# Altium project soldering_station_revB.PrjPcb
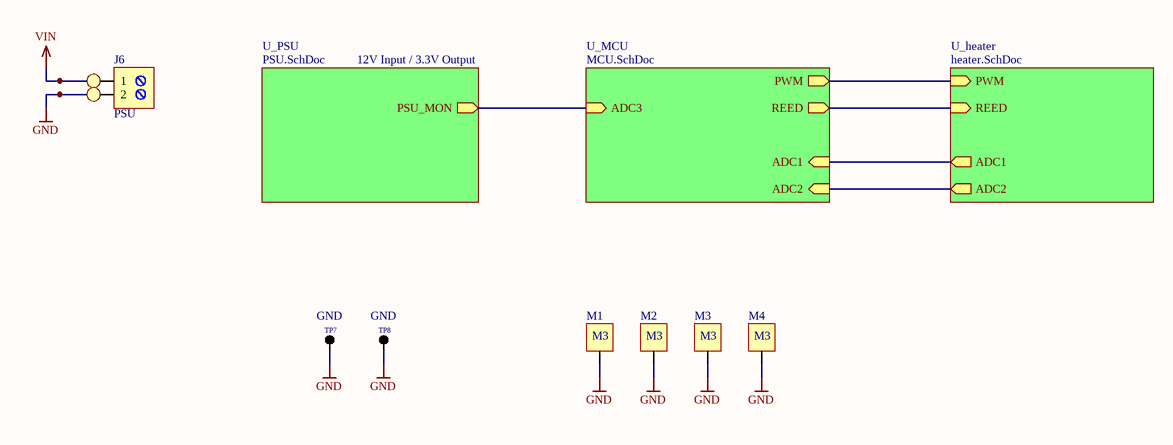
[diagram p0: top.SchDoc]
4 sheets, 97 parts. Net scope: hierarchical (ports join the sheet entries above them; power ports are global).
Board file: soldering_station_revB.PcbDoc
Sheets:
  top.SchDoc
    U_PSU = PSU.SchDoc
    U_MCU = MCU.SchDoc
    U_heater = heater.SchDoc

## Sheet top.SchDoc
size A4

### Parts
J6  PSU  [J_ARK2]
M1  M3 Hole  [M3 Hole]  (value not drawn)
M2  M3 Hole  [M3 Hole]  (value not drawn)
M3  M3 Hole  [M3 Hole]  (value not drawn)
M4  M3 Hole  [M3 Hole]  (value not drawn)
PAD1  PAD  [PAD_08mm]  (value not drawn)
PAD2  PAD  [PAD_08mm]  (value not drawn)
TP7  GND  [TP_PAD]
TP8  GND  [TP_PAD]

### Sub-sheets
U_heater = heater.SchDoc: PWM (in), ADC2 (out), ADC1 (out), REED (in)
U_MCU = MCU.SchDoc: PWM (out), ADC2 (in), ADC1 (in), REED (out), ADC3 (in)
U_PSU = PSU.SchDoc: PSU_MON (out)

### Nets
GND: J6.2 M1.1 M2.1 M3.1 M4.1 PAD2.1 TP7.1(TP) TP8.1(TP)
VIN: J6.1 PAD1.1
BUCK_MON: sheet U_PSU/PSU_MON, sheet U_MCU/ADC3
PWM_OUT: sheet U_MCU/PWM, sheet U_heater/PWM
REED: sheet U_MCU/REED, sheet U_heater/REED
TR: sheet U_MCU/ADC2, sheet U_heater/ADC2
NetC2_1: sheet U_MCU/ADC1, sheet U_heater/ADC1

### Notes on the sheet
- 12V Input / 3.3V Output
- (in symbol M3 Hole) M3

### Library data of the parts
J6 = J_TB-5.0-P-2P: ARK Screw terminal, 2-Pin; Manufacturer: DEGSON ELECTRONICS; Value: DG301-5.0-02P-12-18A(H); SCH_Footprint: ARK2; Part Number: J_TB-5.0-P-2P; Component Type: Standard; HelpURL: https://datasheet.octopart.com/DG301-5.0-03P-12-18A%28H%29-Degson-datasheet-17801202.pdf; Manufacturer Part Number: DG301-5.0-02P-12-18A(H); Supplier 1: TME; Supplier Part Number 1: DG301-5.0-2/6B; Supplier 2: RS Components; Supplier 3: Farnell; Supplier 4: Mouser; Supplier 5: Digi-Key
M1-M4 = M3 Hole: Inner diamater 3.25 mm Outer diamerer 6 mm
PAD1 PAD2 = J_PAD: PCB Pad; Part Number: J_PAD; SCH_Footprint: 1.4x2.5mm; Supplier 1: TME; Supplier 2: RS Components; Supplier 3: Farnell; Supplier 4: Mouser; Supplier 5: Digi-Key; Supplier 6: LCSC
TP7 TP8 = TP_PAD: Testpoint; SCH_Footprint: SMD; Part Number: TP_PAD; Supplier 1: TME; Supplier 2: RS Components; Supplier 3: Farnell; Supplier 4: Mouser; Supplier 5: Digi-Key; Supplier 6: LCSC

## Sheet PSU.SchDoc
size A4
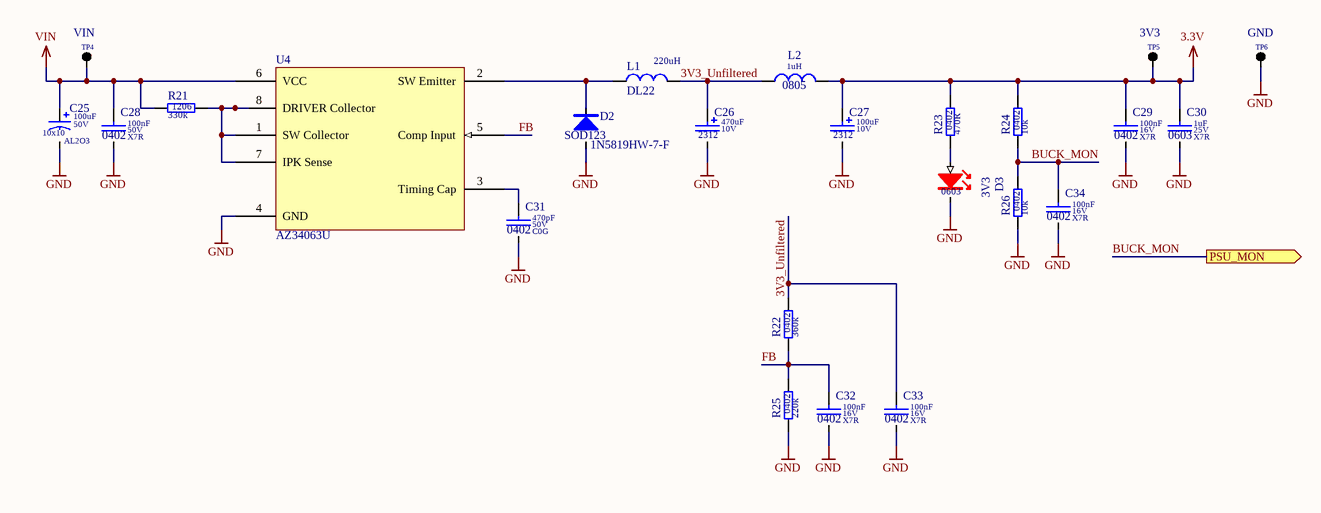
[diagram p1: PSU.SchDoc]

### Parts
C25  value 100uF  Dielectric: AL2O3  SCH_Footprint: 10x10  Voltage: 50V  [CE_D_10x10MM]  (hidden comment: Electrolytic Capacitor)
C26  value 470uF  SCH_Footprint: 2312  Voltage: 10V  [CT_2312_6032]  (hidden comment: Tantalum Capacitor)
C27  value 100uF  SCH_Footprint: 2312  Voltage: 10V  [CT_2312_6032]  (hidden comment: Tantalum Capacitor)
C28  value 100nF  Dielectric: X7R  Voltage: 50V  SCH_Footprint: 0402  [C_0402_1005]  (hidden comment: Ceramic X7R)
C29  value 100nF  Dielectric: X7R  Voltage: 16V  SCH_Footprint: 0402  [C_0402_1005]  (hidden comment: Ceramic X7R)
C30  value 1uF  Dielectric: X7R  Voltage: 25V  SCH_Footprint: 0603  [C_0603_1608]  (hidden comment: Ceramic X7R)
C31  value 470pF  Dielectric: C0G  Voltage: 50V  SCH_Footprint: 0402  [C_0402_1005]  (hidden comment: Ceramic C0G)
C32  value 100nF  Dielectric: X7R  Voltage: 16V  SCH_Footprint: 0402  [C_0402_1005]  (hidden comment: Ceramic X7R)
C33  value 100nF  Dielectric: X7R  Voltage: 16V  SCH_Footprint: 0402  [C_0402_1005]  (hidden comment: Ceramic X7R)
C34  value 100nF  Dielectric: X7R  Voltage: 16V  SCH_Footprint: 0402  [C_0402_1005]  (hidden comment: Ceramic X7R)
D2  value 1N5819HW-7-F  [SOD123]  (hidden comment: 1N5819HW)
D3  3V3  SCH_Footprint: 0603  [OL_0603_1608]
L1  DL22  value 220uH  [DL22]
L2  value 1uH  SCH_Footprint: 0805  [L_0805_2012]  (hidden comment: Inductor)
R21  value 330k  SCH_Footprint: 1206  [R_1206_3216]  (hidden comment: Resistor)
R22  value 360k  SCH_Footprint: 0402  [R_0402_1005]  (hidden comment: Resistor)
R23  value 470R  SCH_Footprint: 0402  [R_0402_1005]  (hidden comment: Resistor)
R24  value 10k  SCH_Footprint: 0402  [R_0402_1005]  (hidden comment: Resistor)
R25  value 220k  SCH_Footprint: 0402  [R_0402_1005]  (hidden comment: Resistor)
R26  value 10k  SCH_Footprint: 0402  [R_0402_1005]  (hidden comment: Resistor)
TP4  VIN  [TP_PAD]
TP5  3V3  [TP_PAD]
TP6  GND  [TP_PAD]
U4  AZ34063U  [AZ34063UMTR-G1]

### Ports
PSU_MON (out)

### Nets
3.3V: C27.1 C29.1 C30.1 L2.2 R23.2 R24.2 TP5.1(TP)
GND: C25.2 C26.2 C27.2 C28.2 C29.2 C30.2 C31.2 C32.2 C33.2 C34.2 D2.2 D3.1(K) R25.1 R26.1 TP6.1(TP) U4.4(GND)
VIN: C25.1 C28.1 R21.1 TP4.1(TP) U4.6(VCC)
3V3_Unfiltered: C26.1 C33.1 L1.1 L2.1 R22.2
BUCK_MON: C34.1 R24.1 R26.2 ; port PSU_MON
FB: C32.1 R22.1 R25.2 U4.5(Comp_Input)
NetC31_1: C31.1 U4.3(Timing_Cap)
NetD2_1: D2.1 L1.2 U4.2(SW_Emitter)
NetD3_2: D3.2(A) R23.1
NetR21_2: R21.2 U4.1(SW_Collector) U4.7(IPK_Sense) U4.8(DRIVER_Collector)

### Library data of the parts
C25 = CE_100uF_50V_AL2O3_10x10_20: Polarized Capacitor; Manufacturer: Nichicon; Manufacturer Part Number: UUX1H101MNL1GS; Tolerance (%): 20; Part Number: CE_100uF_50V_AL2O3_10x10_20; HelpURL: https://datasheet.octopart.com/UUX1H101MNL1GS-Nichicon-datasheet-62047998.pdf; Supplier 1: TME; Supplier Part Number 1: UUX1H101MNL1GS; Supplier 2: RS Components; Supplier Part Number 2: 739-3107; Supplier 3: Farnell; Supplier Part Number 3: 2841943; Supplier 4: Mouser; Supplier Part Number 4: 647-UUX1H101MNL1GS; Supplier 5: Digi-Key; Supplier Part Number 5: 493-6269-1-ND; Supplier 6: LCSC
C26 C27 = CT_22uF_16V_TA2O5_2312_10: Capacitor; Manufacturer: Kemet; Manufacturer Part Number: T494C226K016AT; Dielectric: TA2O5; Tolerance (%): 10; Part Number: CT_22uF_16V_TA2O5_2312_10; HelpURL: https://content.kemet.com/datasheets/KEM_T2008_T494.pdf; Supplier 1: TME; Supplier Part Number 1: T494C226K016AT; Supplier 2: RS Components; Supplier Part Number 2: 1726639; Supplier 3: Farnell; Supplier Part Number 3: 2762195; Supplier 4: Mouser; Supplier Part Number 4: 80-T494C226K016; Supplier 5: Digi-Key; Supplier Part Number 5: 399-3845-1-ND; Supplier 6: LCSC
C28 = C_100nF_50V_X7R_0402_10: Capacitor; Manufacturer: Murata; Manufacturer Part Number: GRM155R71H104KE14D; Tolerance (%): 10; Part Number: C_100nF_50V_X7R_0402_10; HelpURL: http://docs-europe.electrocomponents.com/webdocs/145f/0900766b8145f9d2.pdf; Supplier 1: TME; Supplier Part Number 1: GRM155R71H104KE14D; Supplier 2: RS Components; Supplier Part Number 2: 8847087; Supplier 3: Farnell; Supplier Part Number 3: 2611912; Supplier 4: Mouser; Supplier Part Number 4: 81-GRM155R71H104KE4D; Supplier 5: Digi-Key; Supplier Part Number 5: 490-10700-1-ND; Supplier 6: LCSC
C29 C32-C34 = C_100nF_16V_X7R_0402_10: Capacitor; Manufacturer: Murata; Manufacturer Part Number: GRM155R71C104KA88D; Tolerance (%): 10; Part Number: C_100nF_16V_X7R_0402_10; HelpURL: https://www.mouser.com/ds/2/281/c02e-2905.pdf; Supplier 1: TME; Supplier 2: RS Components; Supplier 3: Farnell; Supplier 4: Mouser; Supplier Part Number 4: 81-GRM155R71C104KA88; Supplier 5: Digi-Key
  C32-C34: Supplier 6: LCSC
C30 = C_1uF_25V_X7R_0603_10: Capacitor; Manufacturer: Samsung; Manufacturer Part Number: CL10B105KA8NNNC; Tolerance (%): 10; Part Number: C_1uF_25V_X7R_0603_10; HelpURL: http://www.tme.eu/pl/Document/4a42202b32dab16128fe107dd69598cc/samsung-chip-cap.pdf; Supplier 1: TME; Supplier Part Number 1: CL10B105KA8NNNC; Supplier 2: RS Components; Supplier 3: Farnell; Supplier 4: Mouser; Supplier 5: Digi-Key
C31 = C_470pF_50V_C0G_0402_5: Capacitor; Manufacturer: AVX; Manufacturer Part Number: 04025A471JAT2A; Tolerance (%): 5; Part Number: C_470pF_50V_C0G_0402_5; HelpURL: http://datasheet.octopart.com/04025A471JAT2A-AVX-datasheet-9883399.pdf; Supplier 1: TME; Supplier 2: RS Components; Supplier Part Number 2: 6983119P; Supplier 3: Farnell; Supplier Part Number 3: 2280781; Supplier 4: Mouser; Supplier Part Number 4: 581-04025A471JAT2A; Supplier 5: Digi-Key; Supplier Part Number 5: 478-7880-1-ND; Supplier 6: LCSC
D2 = D_1N5819HW_1A_40V_SOD123: Manufacturer: Diodes Inc; Voltage: 40V; Current: 1A; SCH_Footprint: SOD123; Part Number: D_1N5819HW_1A_40V_SOD123; HelpURL: https://datasheet.octopart.com/1N5819HW-7-F-Diodes-Inc.-datasheet-8332965.pdf; Manufacturer Part Number: 1N5819HW-7-F; Supplier 1: TME; Supplier Part Number 1: 1N5819HW-7-F; Supplier 2: RS Components; Supplier Part Number 2: 7082197; Supplier 3: Farnell; Supplier Part Number 3: 1773475; Supplier 4: Mouser; Supplier Part Number 4: 621-1N5819HW-F; Supplier 5: Digi-Key; Supplier Part Number 5: 1N5819HW-FDICT-ND; Supplier 6: LCSC
D3 = OL_R_0603: LED_RED; Manufacturer: Lite-On; Value: LTST-C190KRKT; Part Number: OL_R_0603; HelpURL: https://datasheet.octopart.com/LTST-C190KRKT-Lite-On-datasheet-158191.pdf; Manufacturer Part Number: LTST-C190KRKT; Supplier 1: TME; Supplier Part Number 1: LTST-C190KRKT; Supplier 2: RS Components; Supplier Part Number 2: 1769795; Supplier 3: Farnell; Supplier 4: Mouser; Supplier Part Number 4: 859-LTST-C190KRKT; Supplier 5: Digi-Key; Supplier Part Number 5: 160-1436-1-ND
L1 = DL22: Dławik: drutowy; SMD; 1uH; Ipracy: 7,1A; 8mΩ; Isat: 7,6A; B: 9,4mm
L2 = L_15uH_250mA_0805: Induction; Part Number: NL05KTC1R0; Manufacturer: VIKING; Current: 1100mA; Resistance: 169mR; HelpURL: https://www.tme.eu/pl/details/nl05ktc1r0/dlawiki-smd-0805/viking/; Manufacturer Part Number: NL05KTC1R0; Supplier 1: TME; Supplier 2: RS Components; Supplier 3: Farnell; Supplier Part Number 3: 2215651; Supplier 4: Mouser; Supplier Part Number 4: 810-MLZ2012M150WT000; Supplier 5: Digi-Key; Supplier Part Number 5: 445-6397-1-ND; Supplier 6: LCSC; Supplier Part Number 6: C383402
R21 = R_330k_1206_1: Manufacturer: Yageo; Manufacturer Part Number: RC1206FR-07330KL; Voltage: 200V; Power: 250mW; Tolerance: 1%; Part Number: R_330k_1206_1; HelpURL: https://datasheet.octopart.com/RC1206FR-07330KL-Yageo-datasheet-8359522.pdf; Supplier 1: TME; Supplier Part Number 1: RC1206FR-07330KL; Supplier 2: RS Components; Supplier Part Number 2: 1995833; Supplier 3: Farnell; Supplier Part Number 3: 9241094; Supplier 4: Mouser; Supplier Part Number 4: 603-RC1206FR-07330KL; Supplier 5: Digi-Key; Supplier Part Number 5: 311-330KFRCT-ND; Supplier 6: LCSC
R22 = R_360R_0402_1: Manufacturer: Yageo; Manufacturer Part Number: RC0402FR-07360RL; Voltage: 50V; Power: 63mW; Tolerance: 1%; Part Number: R_360R_0402_1; HelpURL: https://datasheet.octopart.com/RC0402FR-07360RL-Yageo-datasheet-62067350.pdf; Supplier 1: TME; Supplier 2: RS Components; Supplier 3: Farnell; Supplier Part Number 3: 2693605; Supplier 4: Mouser; Supplier Part Number 4: 603-RC0402FR-07360RL; Supplier 5: Digi-Key; Supplier Part Number 5: YAG3132CT-ND; Supplier 6: LCSC
R23 = R_470R_0402_1: Manufacturer: Yageo; Manufacturer Part Number: RC0402FR-07470RL; Voltage: 50V; Power: 63mW; Tolerance: 1%; Part Number: R_470R_0402_1; HelpURL: http://datasheet.octopart.com/RC0402FR-07470RL-Yageo-datasheet-10408619.pdf; Supplier 1: TME; Supplier Part Number 1: RC0402FR-07470R; Supplier 2: RS Components; Supplier 3: Farnell; Supplier Part Number 3: 9239197; Supplier 4: Mouser; Supplier Part Number 4: 603-RC0402FR-07470RL; Supplier 5: Digi-Key; Supplier Part Number 5: 311-470LRCT-ND
R24 R26 = R_10k_0402_1: Manufacturer: Yageo; Manufacturer Part Number: RC0402FR-0710KL; Voltage: 50V; Power: 63mW; Tolerance: 1%; Part Number: R_10k_0402_1; HelpURL: http://www.tme.eu/pl/Document/1a2bc76e2be68b3b1670068306778ce6/rc0402yageo.pdf; Supplier 1: TME; Supplier Part Number 1: RC0402FR-0710K; Supplier 2: RS Components; Supplier 3: Farnell; Supplier 4: Mouser; Supplier 5: Digi-Key; Supplier 6: LCSC
R25 = R_220k_0402_1: Manufacturer: Vishay; Manufacturer Part Number: CRCW0402220KFKED; Voltage: 50V; Power: 63mW; Tolerance: 1%; Part Number: R_220k_0402_1; HelpURL: https://www.farnell.com/datasheets/2310790.pdf; Supplier 1: TME; Supplier 2: RS Components; Supplier Part Number 2: 678-8967; Supplier 3: Farnell; Supplier Part Number 3: 2140958; Supplier 4: Mouser; Supplier Part Number 4: 71-CRCW0402-220K-E3; Supplier 5: Digi-Key; Supplier Part Number 5: 541-220KLCT-ND; Supplier 6: LCSC
TP4-TP6 = TP_PAD: Testpoint; SCH_Footprint: SMD; Part Number: TP_PAD; Supplier 1: TME; Supplier 2: RS Components; Supplier 3: Farnell; Supplier 4: Mouser; Supplier 5: Digi-Key
  TP4 TP5: Component Type: Standard (No BOM)
  TP6: Supplier 6: LCSC
U4 = AZ34063UMTR-G1: IC: PMIC; przetwornica DC/DC; Uwej: 3÷36VDC; Uwyj: 1,25÷36VDC; 1,5A

## Sheet MCU.SchDoc
size A4
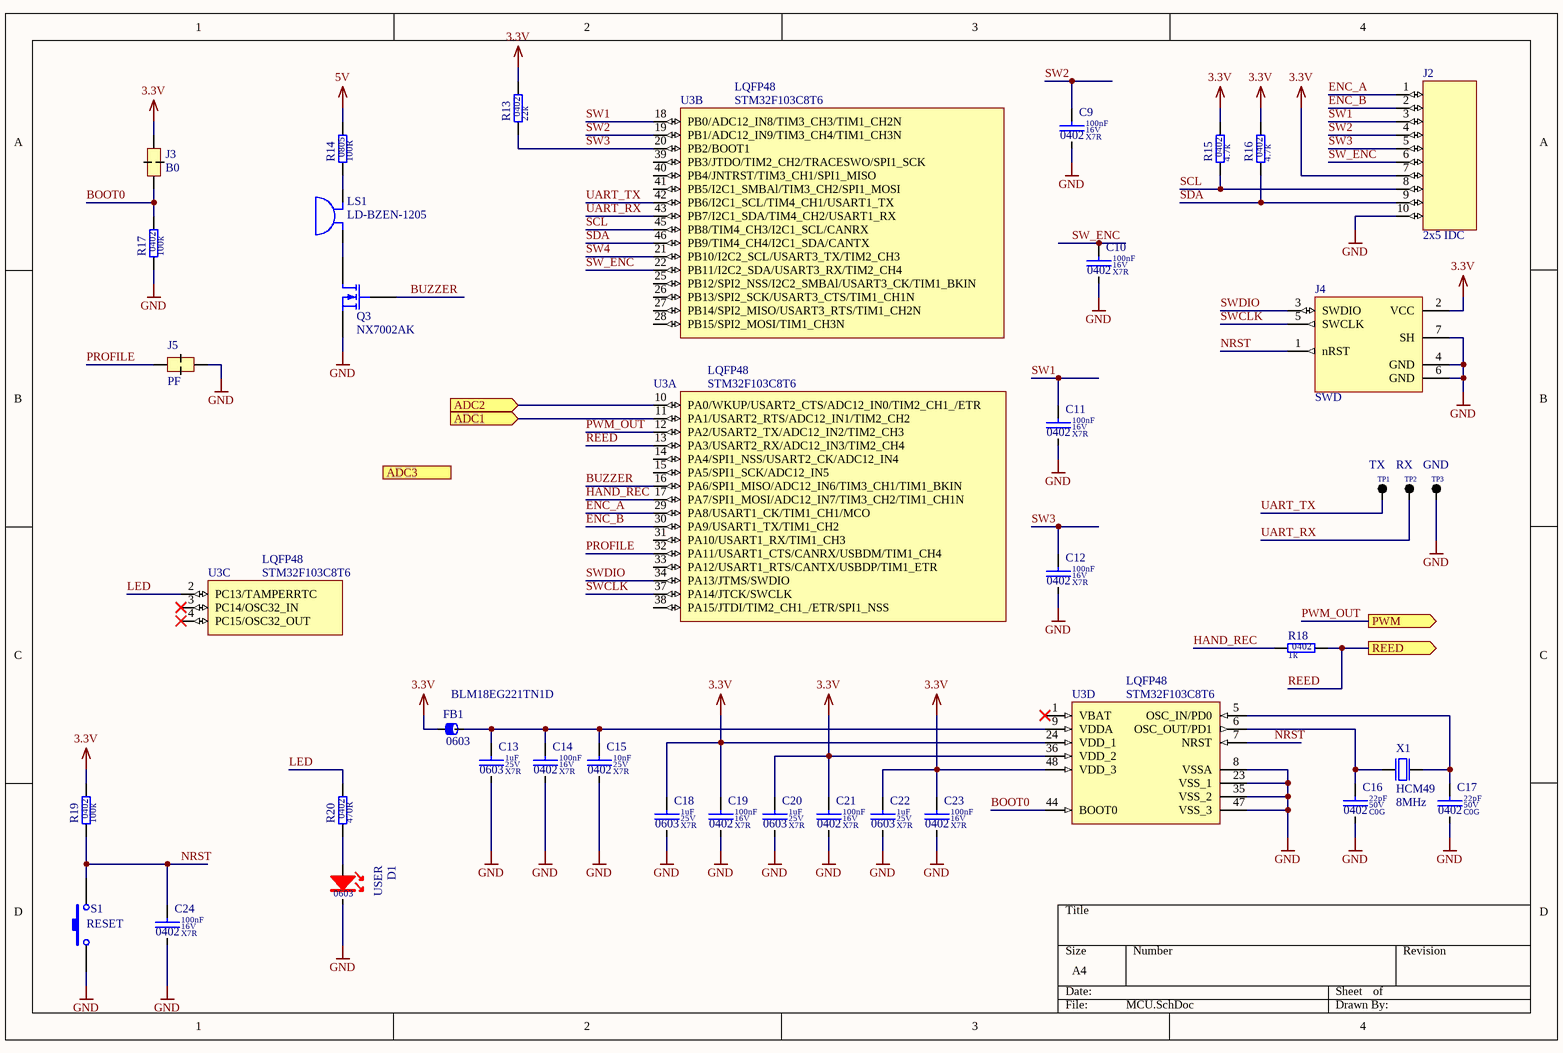
[diagram p2: MCU.SchDoc]

### Parts
C9  value 100nF  Dielectric: X7R  Voltage: 16V  SCH_Footprint: 0402  [C_0402_1005]  (hidden comment: Ceramic X7R)
C10  value 100nF  Dielectric: X7R  Voltage: 16V  SCH_Footprint: 0402  [C_0402_1005]  (hidden comment: Ceramic X7R)
C11  value 100nF  Dielectric: X7R  Voltage: 16V  SCH_Footprint: 0402  [C_0402_1005]  (hidden comment: Ceramic X7R)
C12  value 100nF  Dielectric: X7R  Voltage: 16V  SCH_Footprint: 0402  [C_0402_1005]  (hidden comment: Ceramic X7R)
C13  value 1uF  Dielectric: X7R  Voltage: 25V  SCH_Footprint: 0603  [C_0603_1608]  (hidden comment: Ceramic X7R)
C14  value 100nF  Dielectric: X7R  Voltage: 16V  SCH_Footprint: 0402  [C_0402_1005]  (hidden comment: Ceramic X7R)
C15  value 10nF  Dielectric: X7R  Voltage: 25V  SCH_Footprint: 0402  [C_0402_1005]  (hidden comment: Ceramic X7R)
C16  value 22pF  Dielectric: C0G  Voltage: 50V  SCH_Footprint: 0402  [C_0402_1005]  (hidden comment: Ceramic C0G)
C17  value 22pF  Dielectric: C0G  Voltage: 50V  SCH_Footprint: 0402  [C_0402_1005]  (hidden comment: Ceramic C0G)
C18  value 1uF  Dielectric: X7R  Voltage: 25V  SCH_Footprint: 0603  [C_0603_1608]  (hidden comment: Ceramic X7R)
C19  value 100nF  Dielectric: X7R  Voltage: 16V  SCH_Footprint: 0402  [C_0402_1005]  (hidden comment: Ceramic X7R)
C20  value 1uF  Dielectric: X7R  Voltage: 25V  SCH_Footprint: 0603  [C_0603_1608]  (hidden comment: Ceramic X7R)
C21  value 100nF  Dielectric: X7R  Voltage: 16V  SCH_Footprint: 0402  [C_0402_1005]  (hidden comment: Ceramic X7R)
C22  value 1uF  Dielectric: X7R  Voltage: 25V  SCH_Footprint: 0603  [C_0603_1608]  (hidden comment: Ceramic X7R)
C23  value 100nF  Dielectric: X7R  Voltage: 16V  SCH_Footprint: 0402  [C_0402_1005]  (hidden comment: Ceramic X7R)
C24  value 100nF  Dielectric: X7R  Voltage: 16V  SCH_Footprint: 0402  [C_0402_1005]  (hidden comment: Ceramic X7R)
D1  USER  SCH_Footprint: 0603  [OL_0603_1608]
FB1  value BLM18EG221TN1D  SCH_Footprint: 0603  [FB_0603_1608]  (hidden comment: Ferrite bead)
J2  2x5 IDC  [IDC 2x5 EDGE]
J3  B0  [SOLDER BRIDGE 0402]
J4  SWD  [TagConnectSWD]
J5  PF  [SOLDER BRIDGE 0402]
LS1  LD-BZEN-1205  [LD-BZEN-1205]
Q3  NX7002AK  [NX7002AK.215]
R13  value 22k  SCH_Footprint: 0402  [R_0402_1005]  (hidden comment: Resistor)
R14  value 100R  SCH_Footprint: 0805  [R_0805_2012]  (hidden comment: Resistor)
R15  value 4.7k  SCH_Footprint: 0402  [R_0402_1005]  (hidden comment: Resistor)
R16  value 4.7k  SCH_Footprint: 0402  [R_0402_1005]  (hidden comment: Resistor)
R17  value 100k  SCH_Footprint: 0402  [R_0402_1005]  (hidden comment: Resistor)
R18  value 1k  SCH_Footprint: 0402  [R_0402_1005]  (hidden comment: Resistor)
R19  value 100k  SCH_Footprint: 0402  [R_0402_1005]  (hidden comment: Resistor)
R20  value 470R  SCH_Footprint: 0402  [R_0402_1005]  (hidden comment: Resistor)
S1  RESET  [S_TACTSWITCH3x6]
TP1  TX  [TP_PAD]
TP2  RX  [TP_PAD]
TP3  GND  [TP_PAD]
U3  SCH_Footprint: LQFP48  [LQFP48_7x7]  (hidden comment: STM32F103C8T6)  (parts A,B,C,D of 4)
X1  value 8MHz  SCH_Footprint: HCM49  [X_HC49_SMD]  (hidden comment: 6MHz Crystal)

### Ports
ADC1 (in), ADC2 (in), ADC3 (in), PWM (out), REED (out)

### Nets
3.3V: C18.1 C19.1 C20.1 C21.1 C22.1 C23.1 FB1.1 J2.7 J3.1 J4.2(VCC) R13.2 R15.2 R16.2 R19.2 U3.24(VDD_1) U3.36(VDD_2) U3.48(VDD_3)
5V: R14.2
GND: C9.2 C10.2 C11.2 C12.2 C13.2 C14.2 C15.2 C16.2 C17.2 C18.2 C19.2 C20.2 C21.2 C22.2 C23.2 C24.2 D1.1(K) J2.10 J4.4(GND) J4.6(GND) J4.7(SH) J5.1 Q3.2(S) R17.1 S1.1 TP3.1(TP) U3.8(VSSA) U3.23(VSS_1) U3.35(VSS_2) U3.47(VSS_3)
BOOT0: J3.2 R17.2 U3.44(BOOT0)
BUZZER: Q3.1(G) U3.16(PA6/SPI1_MISO/ADC12_IN6/TIM3_CH1/TIM1_BKIN)
ENC_A: J2.1 U3.29(PA8/USART1_CK/TIM1_CH1/MCO)
ENC_B: J2.2 U3.30(PA9/USART1_TX/TIM1_CH2)
HAND_REC: R18.1 U3.17(PA7/SPI1_MOSI/ADC12_IN7/TIM3_CH2/TIM1_CH1N)
LED: R20.2 U3.2(PC13/TAMPERRTC)
NRST: C24.1 J4.1(nRST) R19.1 S1.2 U3.7(NRST)
PROFILE: J5.2 U3.32(PA11/USART1_CTS/CANRX/USBDM/TIM1_CH4)
PWM_OUT: U3.12(PA2/USART2_TX/ADC12_IN2/TIM2_CH3) ; port PWM
REED: R18.2 U3.13(PA3/USART2_RX/ADC12_IN3/TIM2_CH4) ; port REED
SCL: J2.8 R15.1 U3.45(PB8/TIM4_CH3/I2C1_SCL/CANRX)
SDA: J2.9 R16.1 U3.46(PB9/TIM4_CH4/I2C1_SDA/CANTX)
SW1: C11.1 J2.3 U3.18(PB0/ADC12_IN8/TIM3_CH3/TIM1_CH2N)
SW2: C9.1 J2.4 U3.19(PB1/ADC12_IN9/TIM3_CH4/TIM1_CH3N)
SW3: C12.1 J2.5 R13.1 U3.20(PB2/BOOT1)
SW4: U3.21(PB10/I2C2_SCL/USART3_TX/TIM2_CH3)
SW_ENC: C10.1 J2.6 U3.22(PB11/I2C2_SDA/USART3_RX/TIM2_CH4)
SWCLK: J4.5(SWCLK) U3.37(PA14/JTCK/SWCLK)
SWDIO: J4.3(SWDIO) U3.34(PA13/JTMS/SWDIO)
TR: U3.10(PA0/WKUP/USART2_CTS/ADC12_IN0/TIM2_CH1_/ETR) ; port ADC2
UART_RX: TP2.1(TP) U3.43(PB7/I2C1_SDA/TIM4_CH2/USART1_RX)
UART_TX: TP1.1(TP) U3.42(PB6/I2C1_SCL/TIM4_CH1/USART1_TX)
NetC2_1: U3.11(PA1/USART2_RTS/ADC12_IN1/TIM2_CH2) ; port ADC1
NetC13_1: C13.1 C14.1 C15.1 FB1.2 U3.9(VDDA)
NetC16_1: C16.1 U3.6(OSC_OUT/PD1) X1.1
NetC17_1: C17.1 U3.5(OSC_IN/PD0) X1.2
NetD1_2: D1.2(A) R20.1
NetLS1_1: LS1.1 R14.1
NetLS1_2: LS1.2 Q3.3(D)

Not connected (* = marked no-connect by the designer): U3 1(VBAT)* 3(PC14/OSC32_IN)* 4(PC15/OSC32_OUT)* 14(PA4/SPI1_NSS/USART2_CK/ADC12_IN4) 15(PA5/SPI1_SCK/ADC12_IN5) 25(PB12/SPI2_NSS/I2C2_SMBAl/USART3_CK/TIM1_BKIN) 26(PB13/SPI2_SCK/USART3_CTS/TIM1_CH1N) 27(PB14/SPI2_MISO/USART3_RTS/TIM1_CH2N) 28(PB15/SPI2_MOSI/TIM1_CH3N) 31(PA10/USART1_RX/TIM1_CH3) 33(PA12/USART1_RTS/CANTX/USBDP/TIM1_ETR) 38(PA15/JTDI/TIM2_CH1_/ETR/SPI1_NSS) 39(PB3/JTDO/TIM2_CH2/TRACESWO/SPI1_SCK) 40(PB4/JNTRST/TIM3_CH1/SPI1_MISO) 41(PB5/I2C1_SMBAl/TIM3_CH2/SPI1_MOSI)

### Library data of the parts
C9-C12 C14 C19 C21 C23 C24 = C_100nF_16V_X7R_0402_10: as C29 on sheet PSU; Part Number: C_100nF_16V_X7R_0402_10; HelpURL: https://www.mouser.com/ds/2/281/c02e-2905.pdf; Supplier 1: TME; Supplier 2: RS Components; Supplier 3: Farnell; Supplier 4: Mouser; Supplier Part Number 4: 81-GRM155R71C104KA88; Supplier 5: Digi-Key
C13 C18 C20 C22 = C_1uF_25V_X7R_0603_10: as C30 on sheet PSU; Part Number: C_1uF_25V_X7R_0603_10; HelpURL: http://www.tme.eu/pl/Document/4a42202b32dab16128fe107dd69598cc/samsung-chip-cap.pdf; Supplier 1: TME; Supplier Part Number 1: CL10B105KA8NNNC; Supplier 2: RS Components; Supplier 3: Farnell; Supplier 4: Mouser; Supplier 5: Digi-Key
C15 = C_10nF_25V_X7R_0402_10: Capacitor; Manufacturer: Murata; Manufacturer Part Number: GRM155R71E103KA01D; Tolerance (%): 10; Part Number: C_10nF_25V_X7R_0402_10; HelpURL: http://www.tme.eu/en/Document/e3e731e59cc68b1ab6d46b158bb05733/MURATA_GRM.pdf; Supplier 1: TME; Supplier Part Number 1: GRM155R71E103KA01D; Supplier 2: RS Components; Supplier Part Number 2: 6242301; Supplier 3: Farnell; Supplier Part Number 3: 8819734; Supplier 4: Mouser; Supplier Part Number 4: 81-GRM36X103K25; Supplier 5: Digi-Key; Supplier Part Number 5: 490-1312-1-ND
C16 C17 = C_22pF_50V_C0G_0402_5: Capacitor; Manufacturer: AVX; Manufacturer Part Number: 04025A220JAT2A; Tolerance (%): 5; Part Number: C_22pF_50V_C0G_0402_5; HelpURL: http://datasheet.octopart.com/04025A220JAT2A-AVX-datasheet-9883399.pdf; Supplier 1: TME; Supplier Part Number 1: 04025A220JAT2A; Supplier 2: RS Components; Supplier Part Number 2: 6983087; Supplier 3: Farnell; Supplier Part Number 3: 2280776; Supplier 4: Mouser; Supplier Part Number 4: 581-04025A220J; Supplier 5: Digi-Key; Supplier Part Number 5: 478-1074-1-ND
D1 = OL_R_0603: as D3 on sheet PSU; Part Number: OL_R_0603; HelpURL: https://datasheet.octopart.com/LTST-C190KRKT-Lite-On-datasheet-158191.pdf; Manufacturer Part Number: LTST-C190KRKT; Supplier 1: TME; Supplier Part Number 1: LTST-C190KRKT; Supplier 2: RS Components; Supplier Part Number 2: 1769795; Supplier 3: Farnell; Supplier 4: Mouser; Supplier Part Number 4: 859-LTST-C190KRKT; Supplier 5: Digi-Key; Supplier Part Number 5: 160-1436-1-ND
FB1 = FB_BLM18EG221TN1D: Manufacturer: Murata; Current: 1A; Resistance: 150mR; Part Number: FB_BLM18EG221TN1D; HelpURL: http://datasheet.octopart.com/BLM18EG221TN1D-Murata-datasheet-66919.pdf; Manufacturer Part Number: BLM18EG221TN1D; Supplier 1: TME; Supplier 2: RS Components; Supplier Part Number 2: 7926243P; Supplier 3: Farnell; Supplier Part Number 3: 1515717; Supplier 4: Mouser; Supplier Part Number 4: 81-BLM18EG221TN1D; Supplier 5: Digi-Key; Supplier Part Number 5: 490-5979-1-ND; Supplier 6: LCSC
J2 = IDC_2x5: 2x5 IDC Header
J3 J5 = Solder Bridge: Solder Bridge Jumper
J4 = TagConnectSWD: TagConnect and 1.27mm IDC SWD Header
LS1 = LD-BZEN-1205: Przetwornik dźwięku: elektromagnetyczny; THT; 2,4kHz; 40mA; H: 9mm
Q3 = NX7002AK.215: Tranzystor: N-MOSFET; unipolarny; 60V; 0,12A; 325mW; SOT23
R13 = R_22k_0402_1: Manufacturer: Panasonic; Manufacturer Part Number: ERA-2AEB223X; Voltage: 50V; Power: 63mW; Tolerance: 1%; Part Number: R_22k_0402_1; HelpURL: http://www.mouser.com/ds/2/315/AOA0000C237-1100991.pdf; Supplier 1: TME; Supplier 2: RS Components; Supplier Part Number 2: 566557; Supplier 3: Farnell; Supplier Part Number 3: 1577719; Supplier 4: Mouser; Supplier Part Number 4: 667-ERA-2AEB223X; Supplier 5: Digi-Key; Supplier Part Number 5: P22KDCCT-ND
R14 = R_100R_0805_1: Manufacturer: Yageo; Manufacturer Part Number: RC0805FR-07100RL; Voltage: 150V; Power: 125mW; Tolerance: 1%; Part Number: R_100R_0805_1; HelpURL: https://www.tme.eu/pl/Document/7b8fed8c112f8a94930279c22c957f7f/rc0805yageo.pdf; Supplier 1: TME; Supplier Part Number 1: RC0805FR-07100R; Supplier 2: RS Components; Supplier Part Number 2: 618-5135; Supplier 3: Farnell; Supplier Part Number 3: 9237364; Supplier 4: Mouser; Supplier Part Number 4: 603-RC0805FR-07100RL; Supplier 5: Digi-Key; Supplier Part Number 5: 311-100CRCT-ND
R15-R17 R19 = R_100k_0402_1: Manufacturer: Yageo; Manufacturer Part Number: RC0402FR-07100KL; Voltage: 50V; Power: 63mW; Tolerance: 1%; Part Number: R_100k_0402_1; HelpURL: http://www.tme.eu/pl/Document/1a2bc76e2be68b3b1670068306778ce6/rc0402yageo.pdf; Supplier 1: TME; Supplier Part Number 1: RC0402FR-07100K; Supplier 2: RS Components; Supplier 3: Farnell; Supplier Part Number 3: 2131798; Supplier 4: Mouser; Supplier Part Number 4: 603-RC0402FR-07100KL; Supplier 5: Digi-Key; Supplier Part Number 5: 311-100KLRCT-ND
R18 = R_1k_0402_1: Manufacturer: Yageo; Manufacturer Part Number: RC0402FR-071K; Voltage: 50V; Power: 63mW; Tolerance: 1%; Part Number: R_1k_0402_1; HelpURL: http://www.tme.eu/pl/Document/1a2bc76e2be68b3b1670068306778ce6/rc0402yageo.pdf; Supplier 1: TME; Supplier Part Number 1: RC0402FR-071K; Supplier 2: RS Components; Supplier 3: Farnell; Supplier Part Number 3: 9239235; Supplier 4: Mouser; Supplier Part Number 4: 603-RC0402FR-071KP; Supplier 5: Digi-Key; Supplier Part Number 5: 311-1.00KLRCT-ND
R20 = R_470R_0402_1: as R23 on sheet PSU; Part Number: R_470R_0402_1; HelpURL: http://datasheet.octopart.com/RC0402FR-07470RL-Yageo-datasheet-10408619.pdf; Supplier 1: TME; Supplier Part Number 1: RC0402FR-07470R; Supplier 2: RS Components; Supplier 3: Farnell; Supplier Part Number 3: 9239197; Supplier 4: Mouser; Supplier Part Number 4: 603-RC0402FR-07470RL; Supplier 5: Digi-Key; Supplier Part Number 5: 311-470LRCT-ND
S1 = S_TACTSWITCH: Tact Switch; Manufacturer: Ninigi; Manufacturer Part Number: TACTM-34N-F; SCH_Footprint: 3x6mm; Part Number: S_TACTSWITCH; Value: RESET; HelpURL: http://pl.ninigi.com/product/tactm-34n-f/pdf; Supplier 1: TME; Supplier Part Number 1: TACTM-34N-F; Supplier 2: RS Components; Supplier 3: Farnell; Supplier 4: Mouser; Supplier 5: Digi-Key
TP1-TP3 = TP_PAD: Testpoint; SCH_Footprint: SMD; Part Number: TP_PAD; Supplier 1: TME; Supplier 2: RS Components; Supplier 3: Farnell; Supplier 4: Mouser; Supplier 5: Digi-Key; Supplier 6: LCSC
U3 = UP_STM32F103C8T6: Manufacturer: STMicroelectronics; Value: STM32F103C8T6; Part Number: UP_STM32F103C8T6; HelpURL: https://datasheet.octopart.com/STM32F103C8T6-STMicroelectronics-datasheet-48026265.pdf; Manufacturer Part Number: STM32F103C8T6; Supplier 1: TME; Supplier Part Number 1: STM32F103C8T6; Supplier 2: RS Components; Supplier Part Number 2: 1023545; Supplier 3: Farnell; Supplier Part Number 3: 1447637; Supplier 4: Mouser; Supplier Part Number 4: 511-STM32F103C8T6; Supplier 5: Digi-Key; Supplier Part Number 5: 497-6063-ND
X1 = X_6MHz_HCM49: Resonator Ceramic; Manufacturer Part Number: LF XTAL016788; Manufacturer: Ilsi; Part Number: X_6MHz_HCM49; HelpURL: https://www.tme.eu/pl/Document/174d7f33688e5f09d7b9d1d6c85450eb/LFXTAL026900Reel.pdf; Supplier 1: TME; Supplier Part Number 1: 6.00M-SMDHC49R; Supplier 2: RS Components; Supplier Part Number 2: 1463931; Supplier 3: Farnell; Supplier Part Number 3: 9713310; Supplier 4: Mouser; Supplier Part Number 4: 449-LFXTAL016788CUTT; Supplier 5: Digi-Key; Supplier Part Number 5: 1923-1490-1-ND; Supplier 6: LCSC

## Sheet heater.SchDoc
size A4
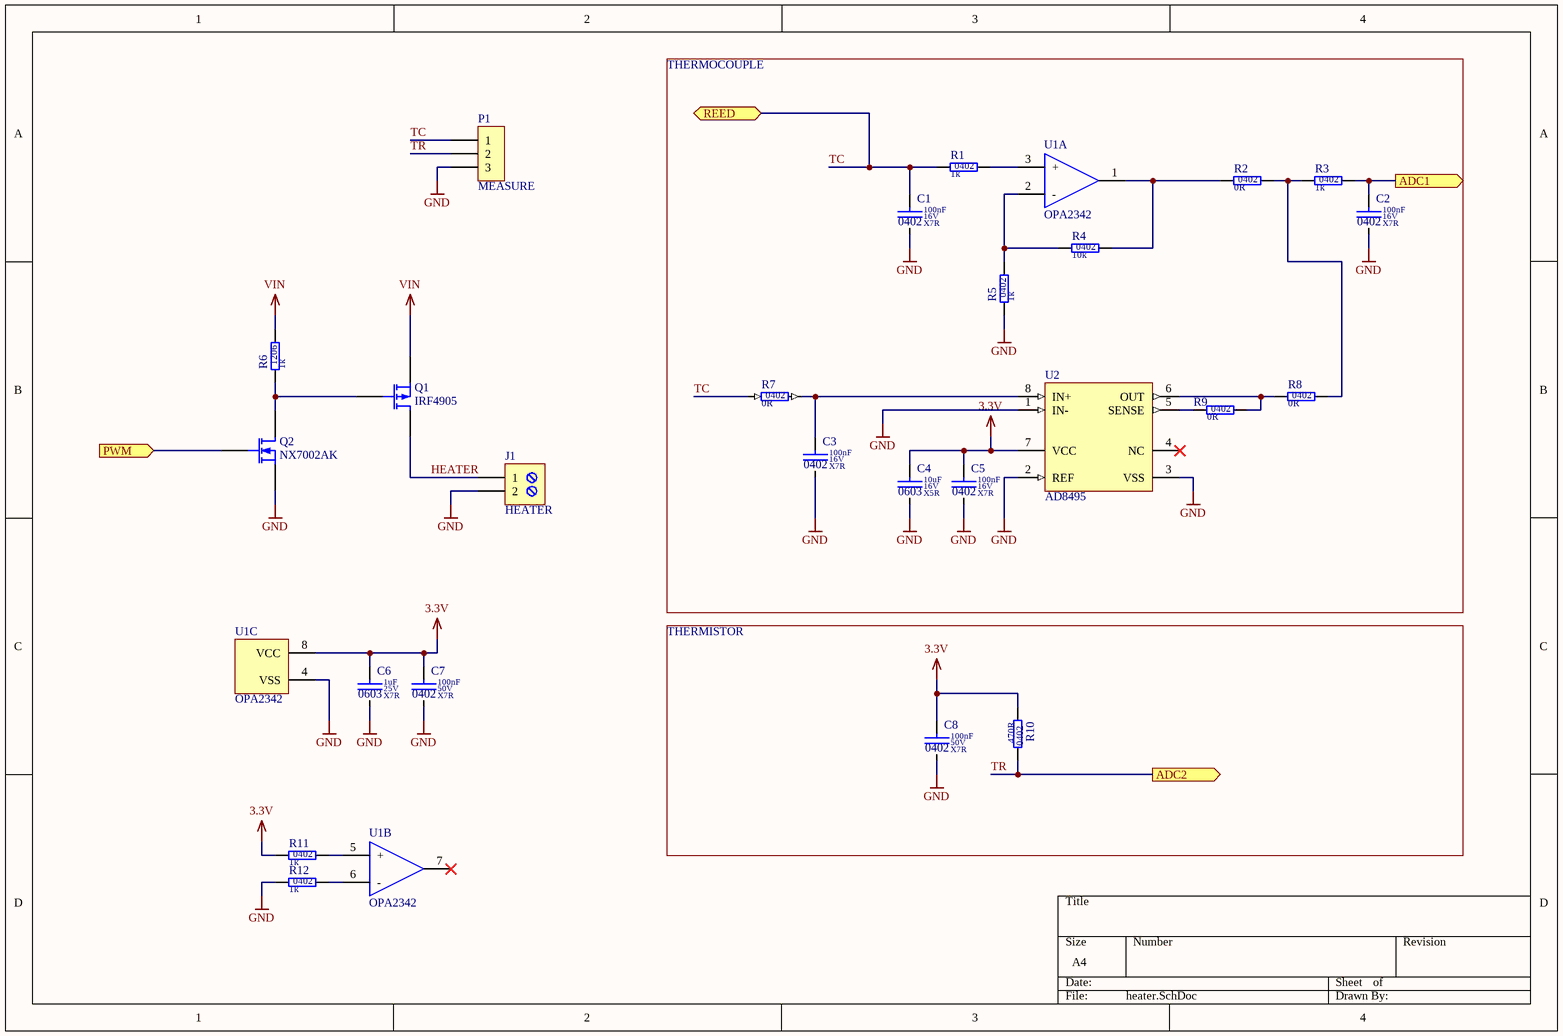
[diagram p3: heater.SchDoc]

### Parts
C1  value 100nF  Dielectric: X7R  Voltage: 16V  SCH_Footprint: 0402  [C_0402_1005]  (hidden comment: Ceramic X7R)
C2  value 100nF  Dielectric: X7R  Voltage: 16V  SCH_Footprint: 0402  [C_0402_1005]  (hidden comment: Ceramic X7R)
C3  value 100nF  Dielectric: X7R  Voltage: 16V  SCH_Footprint: 0402  [C_0402_1005]  (hidden comment: Ceramic X7R)
C4  value 10uF  Dielectric: X5R  Voltage: 16V  SCH_Footprint: 0603  [C_0603_1608]  (hidden comment: Ceramic X5R)
C5  value 100nF  Dielectric: X7R  Voltage: 16V  SCH_Footprint: 0402  [C_0402_1005]  (hidden comment: Ceramic X7R)
C6  value 1uF  Dielectric: X7R  Voltage: 25V  SCH_Footprint: 0603  [C_0603_1608]  (hidden comment: Ceramic X7R)
C7  value 100nF  Dielectric: X7R  Voltage: 50V  SCH_Footprint: 0402  [C_0402_1005]  (hidden comment: Ceramic X7R)
C8  value 100nF  Dielectric: X7R  Voltage: 50V  SCH_Footprint: 0402  [C_0402_1005]  (hidden comment: Ceramic X7R)
J1  HEATER  [J_ARK2]
P1  MEASURE  [P_HEADER_1x3_2.54_ANGLE]
Q1  IRF4905  [IRF4905]
Q2  NX7002AK  [NX7002AK.215]
R1  value 1k  SCH_Footprint: 0402  [R_0402_1005]  (hidden comment: Resistor)
R2  value 0R  SCH_Footprint: 0402  [R_0402_1005]  (hidden comment: Resistor)
R3  value 1k  SCH_Footprint: 0402  [R_0402_1005]  (hidden comment: Resistor)
R4  value 10k  SCH_Footprint: 0402  [R_0402_1005]  (hidden comment: Resistor)
R5  value 1k  SCH_Footprint: 0402  [R_0402_1005]  (hidden comment: Resistor)
R6  value 1k  SCH_Footprint: 1206  [R_1206_3216]  (hidden comment: Resistor)
R7  value 0R  SCH_Footprint: 0402  [R_0402_1005]  (hidden comment: Resistor)
R8  value 0R  SCH_Footprint: 0402  [R_0402_1005]  (hidden comment: Resistor)
R9  value 0R  SCH_Footprint: 0402  [R_0402_1005]  (hidden comment: Resistor)
R10  value 470R  SCH_Footprint: 0402  [R_0402_1005]  (hidden comment: Resistor)
R11  value 1k  SCH_Footprint: 0402  [R_0402_1005]  (hidden comment: Resistor)
R12  value 1k  SCH_Footprint: 0402  [R_0402_1005]  (hidden comment: Resistor)
U1  OPA2342  [OPA2342]  (parts A,B,C of 3)
U2  AD8495  [AD8494]

### Blocks framed on the sheet
THERMOCOUPLE: C1-C5 R1-R5 R7-R9 U1 U2
THERMISTOR: C8 R10

### Ports
ADC1 (out), ADC2 (out), PWM (in), REED (bidir)

### Nets
3.3V: C4.1 C5.1 C6.1 C7.1 C8.1 R10.1 R11.1 U1.8(VCC) U2.7(VCC)
GND: C1.2 C2.2 C3.2 C4.2 C5.2 C6.2 C7.2 C8.2 J1.2 P1.3 Q2.2(S) R5.1 R12.1 U1.4(VSS) U2.1(IN-) U2.2(REF) U2.3(VSS)
VIN: Q1.3(S) R6.2
HEATER: J1.1 Q1.2(D)
PWM_OUT: Q2.1(G) ; port PWM
TC: C1.1 P1.1 R1.1 R7.1 ; port REED  [project net REED]
TR: P1.2 R10.2 ; port ADC2
NetC2_1: C2.1 R3.2 ; port ADC1
NetC3_1: C3.1 R7.2 U2.8(IN+)
NetQ1_1: Q1.1(G) Q2.3(D) R6.1
NetR1_2: R1.2 U1.3(+)
NetR2_1: R2.1 R4.2 U1.1(OUT)
NetR2_2: R2.2 R3.1 R8.2
NetR4_1: R4.1 R5.2 U1.2(-)
NetR8_1: R8.1 R9.2 U2.6(OUT)
NetR9_1: R9.1 U2.5(SENSE)
NetR11_2: R11.2 U1.5(+)
NetR12_2: R12.2 U1.6(-)

Not connected (* = marked no-connect by the designer): U1 7(OUT)*; U2 4(NC)*

### Library data of the parts
C1-C3 C5 = C_100nF_16V_X7R_0402_10: as C29 on sheet PSU; Part Number: C_100nF_16V_X7R_0402_10; HelpURL: https://www.mouser.com/ds/2/281/c02e-2905.pdf; Supplier 1: TME; Supplier 2: RS Components; Supplier 3: Farnell; Supplier 4: Mouser; Supplier Part Number 4: 81-GRM155R71C104KA88; Supplier 5: Digi-Key
  C2: Supplier 6: LCSC
C4 = C_10uF_16V_X5R_0603_20: Capacitor; Manufacturer: Samsung Electro-Mechanics; Manufacturer Part Number: CL10A106MO8NQNC; Tolerance (%): 20; Part Number: C_10uF_16V_X5R_0603_20; HelpURL: http://www.tme.eu/pl/Document/4a42202b32dab16128fe107dd69598cc/samsung-chip-cap.pdf; Supplier 1: TME; Supplier Part Number 1: CL10A106MO8NQNC; Supplier 2: RS Components; Supplier 3: Farnell; Supplier 4: Mouser; Supplier 5: Digi-Key
C6 = C_1uF_25V_X7R_0603_10: as C30 on sheet PSU; Part Number: C_1uF_25V_X7R_0603_10; HelpURL: http://www.tme.eu/pl/Document/4a42202b32dab16128fe107dd69598cc/samsung-chip-cap.pdf; Supplier 1: TME; Supplier Part Number 1: CL10B105KA8NNNC; Supplier 2: RS Components; Supplier 3: Farnell; Supplier 4: Mouser; Supplier 5: Digi-Key
C7 C8 = C_100nF_50V_X7R_0402_10: as C28 on sheet PSU; Part Number: C_100nF_50V_X7R_0402_10; HelpURL: http://docs-europe.electrocomponents.com/webdocs/145f/0900766b8145f9d2.pdf; Supplier 1: TME; Supplier Part Number 1: GRM155R71H104KE14D; Supplier 2: RS Components; Supplier Part Number 2: 8847087; Supplier 3: Farnell; Supplier Part Number 3: 2611912; Supplier 4: Mouser; Supplier Part Number 4: 81-GRM155R71H104KE4D; Supplier 5: Digi-Key; Supplier Part Number 5: 490-10700-1-ND
J1 = J_TB-5.0-P-2P: as J6 on sheet top; Part Number: J_TB-5.0-P-2P; Component Type: Standard; HelpURL: https://datasheet.octopart.com/DG301-5.0-03P-12-18A%28H%29-Degson-datasheet-17801202.pdf; Manufacturer Part Number: DG301-5.0-02P-12-18A(H); Supplier 1: TME; Supplier Part Number 1: DG301-5.0-2/6B; Supplier 2: RS Components; Supplier 3: Farnell; Supplier 4: Mouser; Supplier 5: Digi-Key
P1 = P_HEADER_1x3_2.54_ANGLE: Pin Header; Manufacturer: Molex; SCH_Footprint: 1x3 2.54mm; Value: 22-28-8032; Part Number: P_HEADER_1x3_2.54_ANGLE; HelpURL: https://datasheet.octopart.com/022288032-Molex-datasheet-8335722.pdf; Manufacturer Part Number: 22-28-8032; Supplier 1: TME; Supplier 2: RS Components; Supplier 3: Farnell; Supplier 4: Mouser; Supplier Part Number 4: 538-22-28-8032; Supplier 5: Digi-Key; Supplier Part Number 5: WM50015-03-ND; Supplier 6: LCSC
Q1 = IRF4905: PMOS TO-220
Q2 = NX7002AK.215: as Q3 on sheet MCU
R1 R3 R5 R11 R12 = R_1k_0402_1: as R18 on sheet MCU; Part Number: R_1k_0402_1; HelpURL: http://www.tme.eu/pl/Document/1a2bc76e2be68b3b1670068306778ce6/rc0402yageo.pdf; Supplier 1: TME; Supplier Part Number 1: RC0402FR-071K; Supplier 2: RS Components; Supplier 3: Farnell; Supplier Part Number 3: 9239235; Supplier 4: Mouser; Supplier Part Number 4: 603-RC0402FR-071KP; Supplier 5: Digi-Key; Supplier Part Number 5: 311-1.00KLRCT-ND
  R3: Supplier 6: LCSC
R2 R7-R9 = R_0R_0402_5: Manufacturer: Rohm; Manufacturer Part Number: PMR01ZZPJ000; Voltage: 50V; Power: 100mW; Tolerance: 5%; Part Number: R_0R_0402_5; HelpURL: https://pl.mouser.com/datasheet/2/348/pmr-jpw-e-1139188.pdf; Supplier 1: TME; Supplier 2: RS Components; Supplier 3: Farnell; Supplier 4: Mouser; Supplier Part Number 4: 755-PMR01ZZPJ000; Supplier 5: Digi-Key; Supplier Part Number 5: RHM1692-6-ND
R4 = R_10k_0402_1: as R24 on sheet PSU; Part Number: R_10k_0402_1; HelpURL: http://www.tme.eu/pl/Document/1a2bc76e2be68b3b1670068306778ce6/rc0402yageo.pdf; Supplier 1: TME; Supplier Part Number 1: RC0402FR-0710K; Supplier 2: RS Components; Supplier 3: Farnell; Supplier 4: Mouser; Supplier 5: Digi-Key
R6 = R_47k_1206_1: Manufacturer: Royalohm; Manufacturer Part Number: HP06W2F4702T5E; Voltage: 200V; Power: 500mW; Tolerance: 1%; Part Number: R_47k_1206_1; HelpURL: https://www.tme.eu/pl/Document/fa390a0a31e891a154d3713216995c6e/HighPowerHP.pdf; Supplier 1: TME; Supplier Part Number 1: HP06-47K1%; Supplier 2: RS Components; Supplier 3: Farnell; Supplier 4: Mouser; Supplier 5: Digi-Key
R10 = R_470R_0402_1: as R23 on sheet PSU; Part Number: R_470R_0402_1; HelpURL: http://datasheet.octopart.com/RC0402FR-07470RL-Yageo-datasheet-10408619.pdf; Supplier 1: TME; Supplier Part Number 1: RC0402FR-07470R; Supplier 2: RS Components; Supplier 3: Farnell; Supplier Part Number 3: 9239197; Supplier 4: Mouser; Supplier Part Number 4: 603-RC0402FR-07470RL; Supplier 5: Digi-Key; Supplier Part Number 5: 311-470LRCT-ND
U1 = OPA2342: Wzmacniacz operacyjny; 1MHz; 2,7÷5,5V; Kanały: 2; SO8
U2 = AD8495: Precision Thermocouple Amplifiers / with Cold Junction Compensation

## Nets that join several sheets
3.3V: PSU (7 pins), MCU (17 pins), heater (9 pins)
GND: top (8 pins), PSU (16 pins), MCU (30 pins), heater (17 pins)
VIN: top (J6.1 PAD1.1), PSU (5 pins), heater (Q1.3 R6.2)
NetC2_1: MCU (U3.11), heater (C2.1 R3.2)
PWM_OUT: MCU (U3.12), heater (Q2.1)
REED: MCU (R18.2 U3.13), heater (C1.1 P1.1 R1.1 R7.1)
TR: MCU (U3.10), heater (P1.2 R10.2)